# EAGLE design Rx (EAGLE 9.3.1)
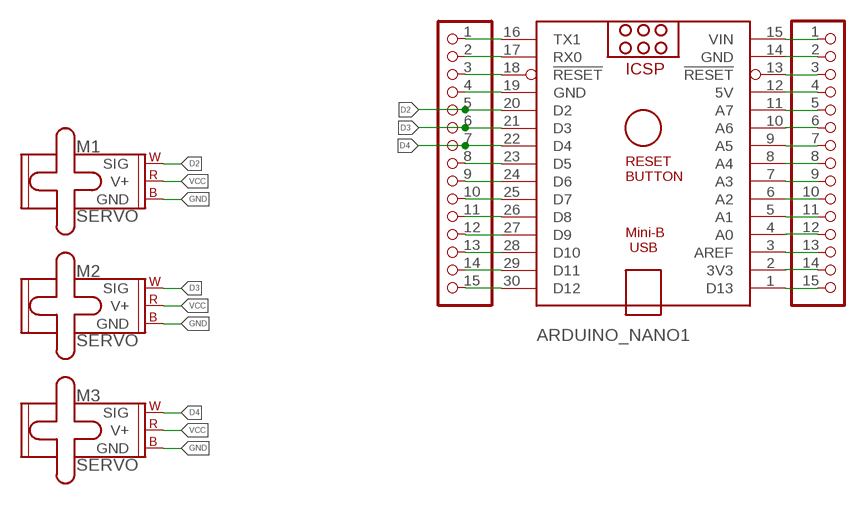
[diagram p0: schematic, sheet 1]

## Parts
ARDUINO_NANO1  ARDUINO_NANO  [ARDUINO_NANO]
JP1  PINHD-1X15-CB  [1X15-CB]
JP2  PINHD-1X15-CB  [1X15-CB]
M1  SERVO  [1X03]
M2  SERVO  [1X03]
M3  SERVO  [1X03]

## Nets
D2: ARDUINO_NANO1.20(D2) JP2.5 M1.1(SIG)
D3: ARDUINO_NANO1.21(D3) JP2.6 M2.1(SIG)
D4: ARDUINO_NANO1.22(D4) JP2.7 M3.1(SIG)
GND: M1.3(GND) M2.3(GND) M3.3(GND)
N$1: ARDUINO_NANO1.16(TX1) JP2.1
N$2: ARDUINO_NANO1.17(RX0) JP2.2
N$3: ARDUINO_NANO1.18(!RESET) JP2.3
N$4: ARDUINO_NANO1.19(GND) JP2.4
N$7: ARDUINO_NANO1.23(D5) JP2.8
N$8: ARDUINO_NANO1.24(D6) JP2.9
N$9: ARDUINO_NANO1.25(D7) JP2.10
N$10: ARDUINO_NANO1.26(D8) JP2.11
N$11: ARDUINO_NANO1.27(D9) JP2.12
N$12: ARDUINO_NANO1.28(D10) JP2.13
N$13: ARDUINO_NANO1.29(D11) JP2.14
N$14: ARDUINO_NANO1.30(D12) JP2.15
N$15: ARDUINO_NANO1.15(VIN) JP1.1
N$16: ARDUINO_NANO1.14(GND) JP1.2
N$17: ARDUINO_NANO1.13(!RESET) JP1.3
N$18: ARDUINO_NANO1.12(5V) JP1.4
N$19: ARDUINO_NANO1.11(A7) JP1.5
N$20: ARDUINO_NANO1.10(A6) JP1.6
N$21: ARDUINO_NANO1.9(A5) JP1.7
N$22: ARDUINO_NANO1.8(A4) JP1.8
N$23: ARDUINO_NANO1.7(A3) JP1.9
N$24: ARDUINO_NANO1.6(A2) JP1.10
N$25: ARDUINO_NANO1.5(A1) JP1.11
N$26: ARDUINO_NANO1.4(A0) JP1.12
N$27: ARDUINO_NANO1.3(AREF) JP1.13
N$28: ARDUINO_NANO1.2(3V3) JP1.14
N$29: ARDUINO_NANO1.1(D13) JP1.15
VCC: M1.2(V+) M2.2(V+) M3.2(V+)

## Library data of the parts
ARDUINO_NANO1 = ArduinoNanoV30:ARDUINO_NANO: Arduino Nano V3.0 Overview: The Arduino Nano is a small, complete, and breadboard-friendly board based on the ATmega328 (Arduino Nano 3.x) or ATmega168 (Arduino Nano 2.x). It has more or less the same functionality of the Arduino Duemilanove, but in a different package. It lacks only a DC power jack, and works with a Mini-B USB cable instead of a standard one. The Nano was designed and is being produced by Gravitech. Specifications: Microcontroller Atmel ATmega168 or ATmega328 Operating Voltage (logic level) 5 V Input Voltage (recommended) 7-12 V Input Voltage (limits) 6-20 V Digital I/O Pins 14 (of which 6 provide PWM output) Analog Input Pins 8 DC Current per I/O Pin 40 mA Flash Memory 16 KB (ATmega168) or 32 KB (ATmega328) of which 2 KB used by bootloader SRAM 1 KB (ATmega168) or 2 KB (ATmega328) EEPROM 512 bytes (ATmega168) or 1 KB (ATmega328) Clock Speed 16 MHz Dimensions 0.73" x 1.70" Length 45 mm Width 18 mm Weigth 5 g Power: The Arduino Nano can be powered via the Mini-B USB connection, 6-20V unregulated external power supply (pin 30), or 5V regulated external power supply (pin 27). The power source is automatically selected to the highest voltage source. Memory: The ATmega168 has 16 KB of flash memory for storing code (of which 2 KB is used for the bootloader); the ATmega328 has 32 KB, (also with 2 KB used for the bootloader). The ATmega168 has 1 KB of SRAM and 512 bytes of EEPROM (which can be read and written with the EEPROM library); the ATmega328 has 2 KB of SRAM and 1 KB of EEPROM. Input and Output: Each of the 14 digital pins on the Nano can be used as an input or output, using pinMode(), digitalWrite(), and digitalRead() functions. They operate at 5 volts. Each pin can provide or receive a maximum of 40 mA and has an internal pull-up resistor (disconnected by default) of 20-50 kOhms. In addition, some pins have specialized functions. Visit Arduino - ArduinoBoardNano <https://www.arduino.cc/en/Main/ArduinoBoardNano>
JP1 JP2 = adafruit:PINHD-1X15: PIN HEADER
M1-M3 = SparkFun-Electromechanical:SERVO: Servo Motor 3-pin connector for a standard servo motor (voltage supply, ground, and control signal.) SparkFun Products Servo - Generic (Sub-Micro Size) <https://www.sparkfun.com/products/9065> (ROB-09065) Servo - Generic High Torque Continuous Rotation (Standard Size) <https://www.sparkfun.com/products/9347> (ROB-09347) Servo - Generic High Torque (Standard Size) <https://www.sparkfun.com/products/11965> (ROB-11965)

## Board
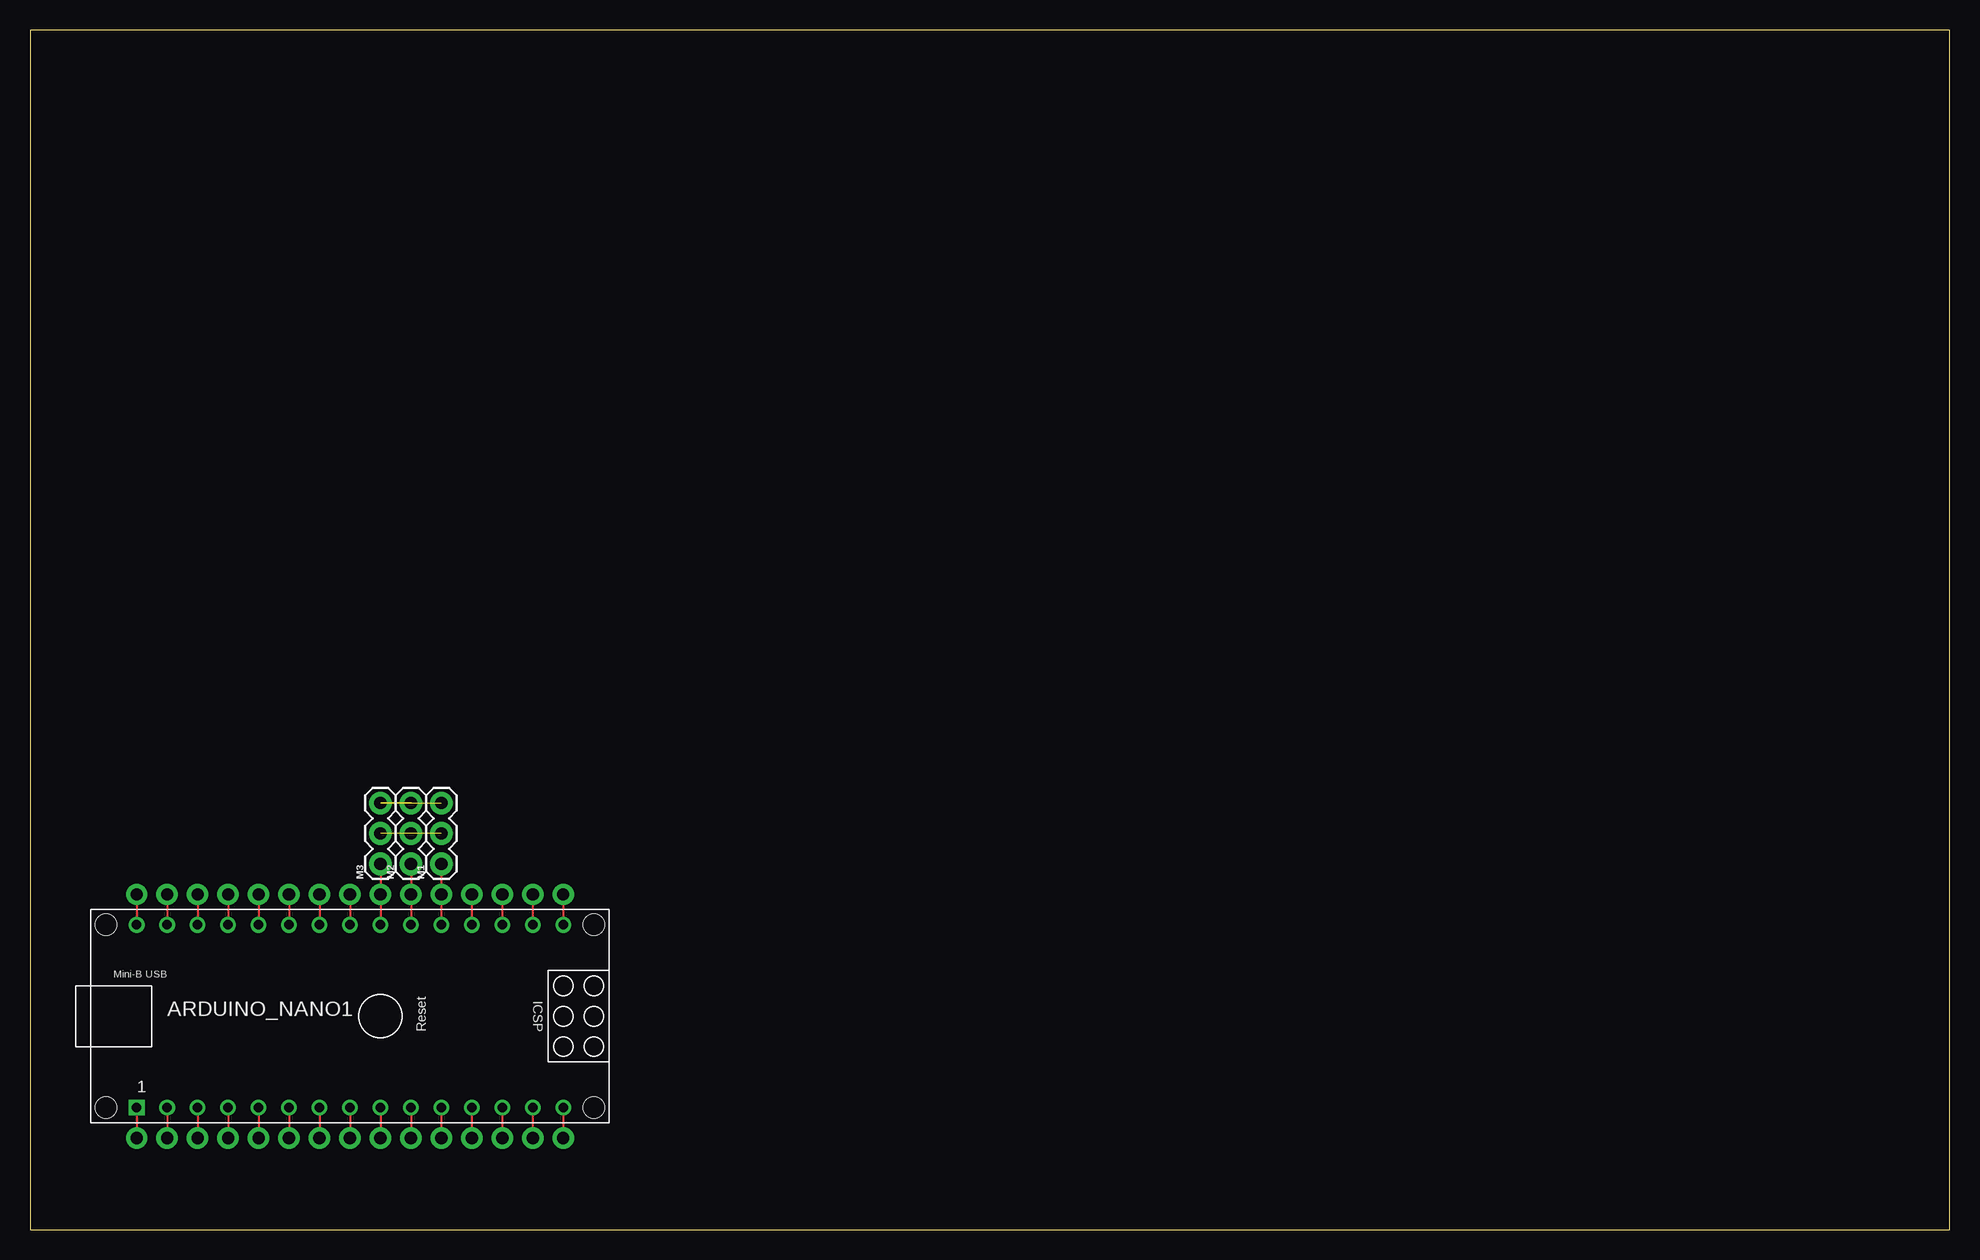
[diagram p1: board, top side]

Size 160 x 100 mm. Coordinates in mm from the lower left corner, seen from the top.
Outline: 0,0 160,0 160,100 0,100 0,0
Copper layers (1*16): Top 0.035mm / dielectric 1.5mm / Bottom 0.035mm
Design rules "default": minimum track width 6mil, minimum drill 0.35mm, track to track 6mil, track to pad 6mil, pad to pad 6mil, via to via 6mil, smd to smd 6mil, copper to edge 40mil, drill to drill 6mil, minimum pad ring 10mil, minimum via ring 8mil, stop-mask expansion 4mil, vias tented up to drill 0mil, thermal gap 10mil

### Footprints (pad centres in the part's own frame; a part is rotated, then mirrored left to right if it is on the bottom)
ARDUINO_NANO = drill 0.8 square: 1 -20.32,-7.62 | drill 0.8: 2 -17.78,-7.62; 3 -15.24,-7.62; 4 -12.7,-7.62; 5 -10.16,-7.62; 6 -7.62,-7.62; 7 -5.08,-7.62; 8 -2.54,-7.62; 9 0,-7.62; 10 2.54,-7.62; 11 5.08,-7.62; 12 7.62,-7.62; 13 10.16,-7.62; 14 12.7,-7.62; 15 15.24,-7.62; 16 15.24,7.62; 17 12.7,7.62; 18 10.16,7.62; 19 7.62,7.62; 20 5.08,7.62; 21 2.54,7.62; 22 0,7.62; 23 -2.54,7.62; 24 -5.08,7.62; 25 -7.62,7.62; 26 -10.16,7.62; 27 -12.7,7.62; 28 -15.24,7.62; 29 -17.78,7.62; 30 -20.32,7.62 | hole 1.778: -22.86,-7.62; -22.86,7.62; 17.78,7.62; 17.78,-7.62
1X15-CB = drill 1.016 pad 1.778: 1 -17.78,0; 2 -15.24,0; 3 -12.7,0; 4 -10.16,0; 5 -7.62,0; 6 -5.08,0; 7 -2.54,0; 8 0,0; 9 2.54,0; 10 5.08,0; 11 7.62,0; 12 10.16,0; 13 12.7,0; 14 15.24,0; 15 17.78,0
1X03 = drill 1.016 pad 1.88: 1 0,0; 2 2.54,0; 3 5.08,0

### Placement (x,y rotation side)
ARDUINO_NANO1  29.21,17.78 0 top
JP1  26.67,7.62 180 top
JP2  26.67,27.94 0 bottom
M1  34.29,30.48 90 top
M2  31.75,30.48 90 top
M3  29.21,30.48 90 top

### Tracks (layer width: path | path; a pad name or v marks a point on that pad's centre or on a via)
D2
  Top 0.152: ARDUINO_NANO1.20 JP2.5 M1.1
D3
  Top 0.152: ARDUINO_NANO1.21 JP2.6 M2.1
D4
  Top 0.152: ARDUINO_NANO1.22 JP2.7 M3.1
GND  (2 unrouted)
N$1
  Top 0.152: JP2.1 ARDUINO_NANO1.16
N$2
  Top 0.152: JP2.2 ARDUINO_NANO1.17
N$3
  Top 0.152: JP2.3 ARDUINO_NANO1.18
N$4
  Top 0.152: JP2.4 ARDUINO_NANO1.19
N$7
  Top 0.152: JP2.8 ARDUINO_NANO1.23
N$8
  Top 0.152: JP2.9 ARDUINO_NANO1.24
N$9
  Top 0.152: JP2.10 ARDUINO_NANO1.25
N$10
  Top 0.152: JP2.11 ARDUINO_NANO1.26
N$11
  Top 0.152: JP2.12 ARDUINO_NANO1.27
N$12
  Top 0.152: JP2.13 ARDUINO_NANO1.28
N$13
  Top 0.152: JP2.14 ARDUINO_NANO1.29
N$14
  Top 0.152: JP2.15 ARDUINO_NANO1.30
N$15
  Top 0.152: ARDUINO_NANO1.15 JP1.1
N$16
  Top 0.152: ARDUINO_NANO1.14 JP1.2
N$17
  Top 0.152: ARDUINO_NANO1.13 JP1.3
N$18
  Top 0.152: ARDUINO_NANO1.12 JP1.4
N$19
  Top 0.152: ARDUINO_NANO1.11 JP1.5
N$20
  Top 0.152: ARDUINO_NANO1.10 JP1.6
N$21
  Top 0.152: ARDUINO_NANO1.9 JP1.7
N$22
  Top 0.152: ARDUINO_NANO1.8 JP1.8
N$23
  Top 0.152: ARDUINO_NANO1.7 JP1.9
N$24
  Top 0.152: ARDUINO_NANO1.6 JP1.10
N$25
  Top 0.152: ARDUINO_NANO1.5 JP1.11
N$26
  Top 0.152: ARDUINO_NANO1.4 JP1.12
N$27
  Top 0.152: ARDUINO_NANO1.3 JP1.13
N$28
  Top 0.152: ARDUINO_NANO1.2 JP1.14
N$29
  Top 0.152: ARDUINO_NANO1.1 JP1.15
VCC  (2 unrouted)